# EasyEDA schematic keyless entry car.json
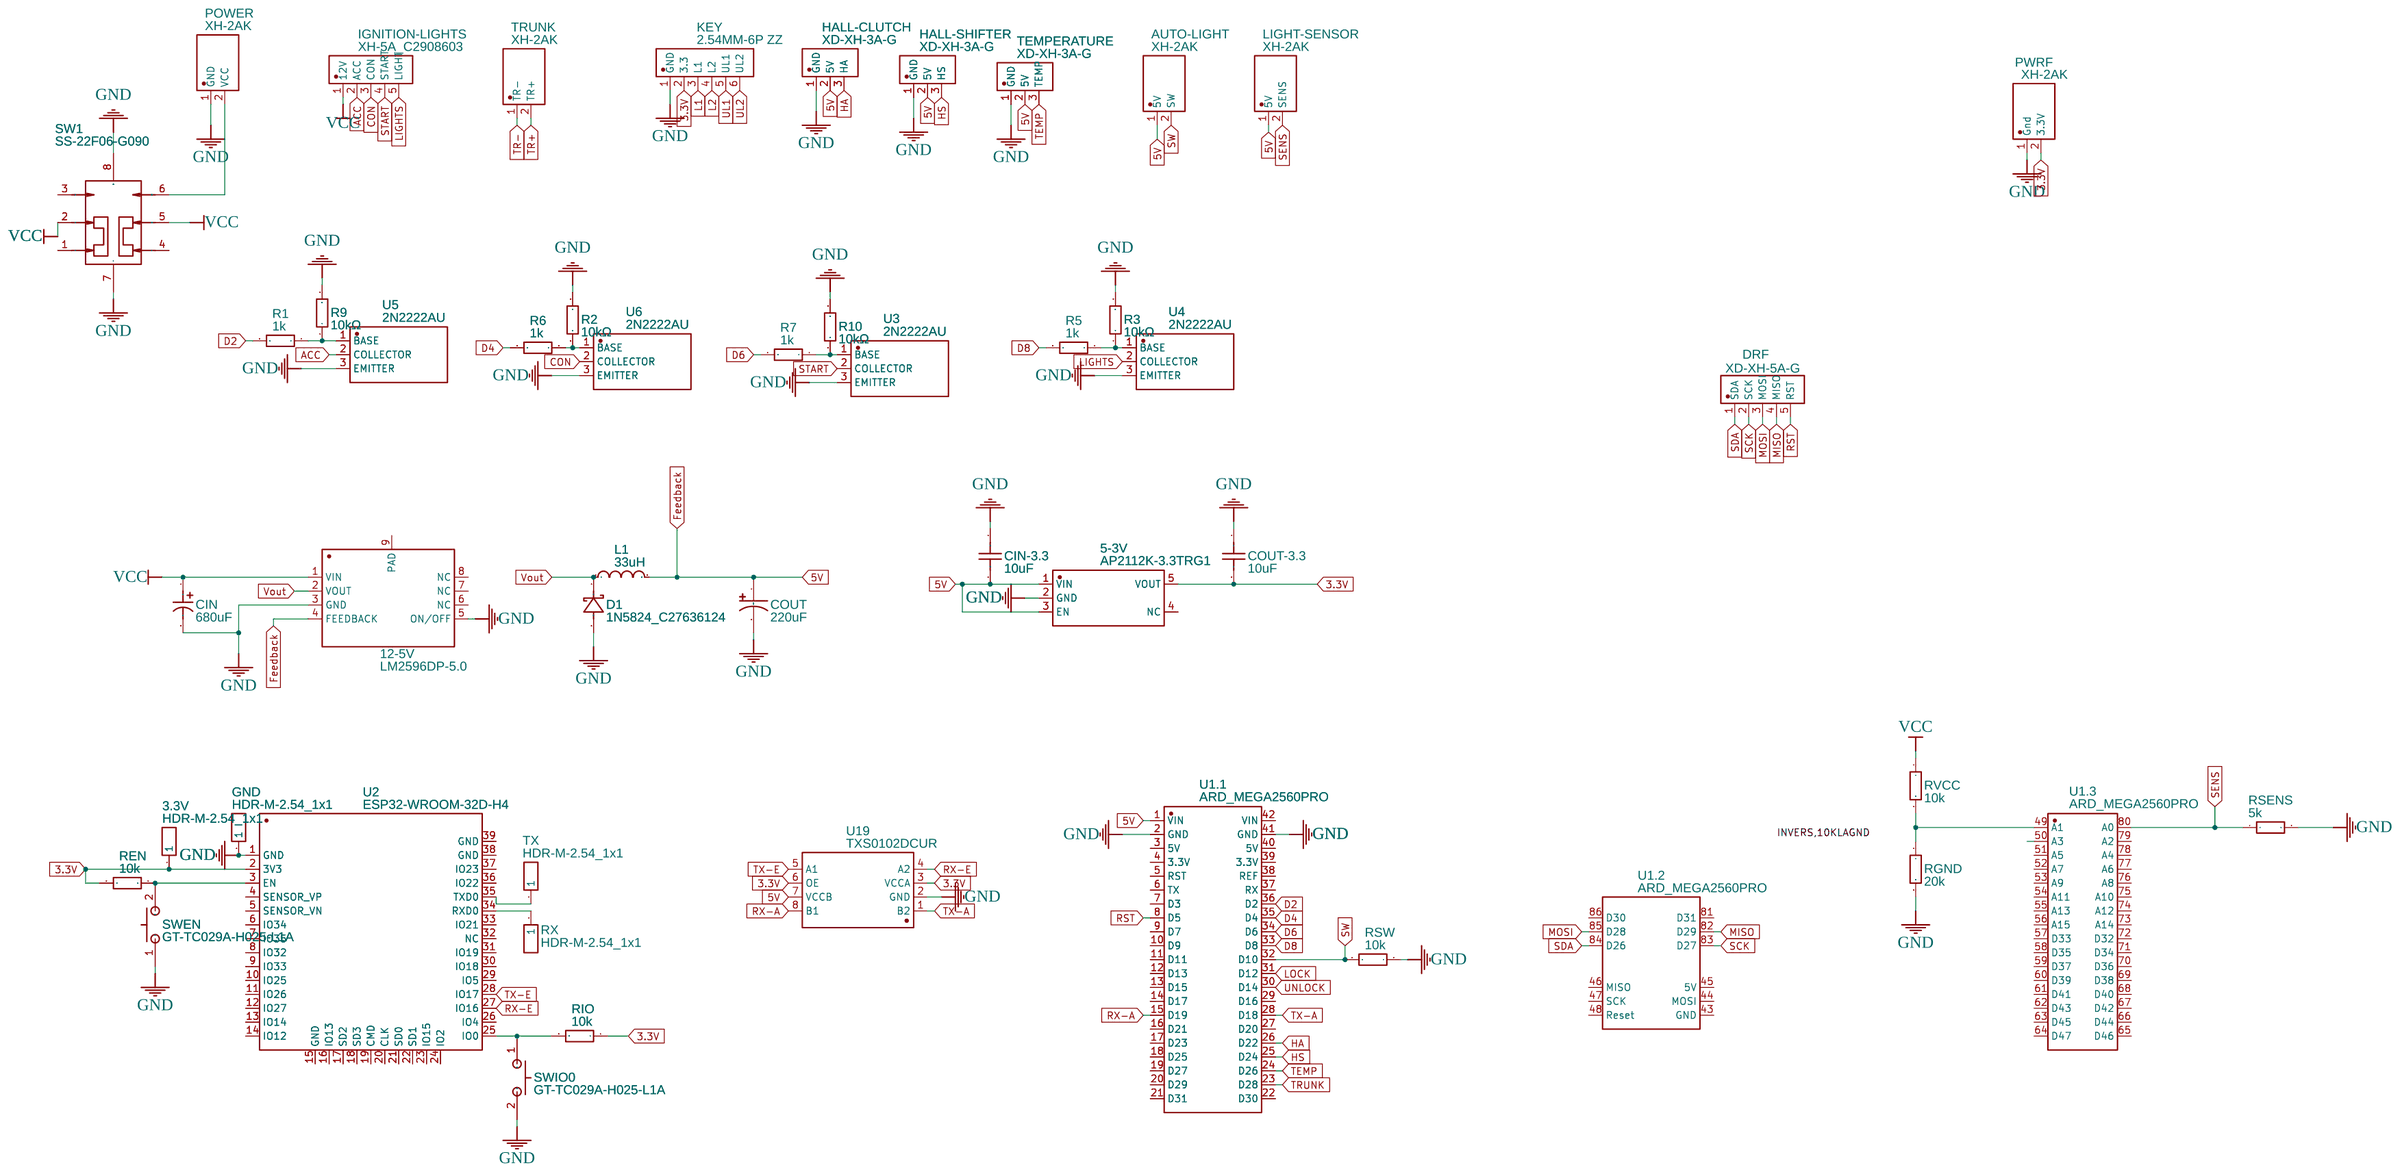
[diagram p0: schematic sheet]

## Parts
3.3V  HDR-M-2.54_1x1  [HDR-M-2.54_1X1]
5-3V  AP2112K-3.3TRG1  [SOT-25-5_L2.9-W1.6-P0.95-LS2.8-BL]
12-5V  LM2596DP-5.0  [SOP-8-PP_L4.9-W3.9-P1.27-LS6.0-BL-EP]
AUTO-LIGHT  XH-2AK  [CONN-TH_XH-2A]
CIN  680uF  [CAP-TH_BD6.3-P2.60-D0.6-FD-1]
CIN-3  10uF  [C0805]  (section 3)
COUT  220uF  [CAP-TH_BD6.3-P2.50-D1.0-FD]
COUT-3  10uF  [C0805]  (section 3)
D1  1N5824_C27636124  [DO-201AD_BD5.3-L9.0-P13.00-D1.3-RD]
DRF  XD-XH-5A-G  [CONN-TH_XH-5A]
GND  HDR-M-2.54_1x1  [HDR-M-2.54_1X1]
HALL-CLUTCH  XD-XH-3A-G  [CONN-TH_3P-P2.50_XH-3A-C9900029692]
HALL-SHIFTER  XD-XH-3A-G  [CONN-TH_3P-P2.50_XH-3A-C9900029692]
IGNITION-LIGHTS  XH-5A_C2908603  [CONN-TH_5P-P2.50_XH-5A]
KEY  2.54MM-6P ZZ  [CONN-TH_6P-P2.50_HCTL_XH-6A_C2908604]
L1  33uH  [IND-SMD_L10.8-W10.0_SLO1040H]
LIGHT-SENSOR  XH-2AK  [CONN-TH_XH-2A]
POWER  XH-2AK  [CONN-TH_XH-2A]
PWRF  XH-2AK  [CONN-TH_XH-2A]
R1  1k  [RES-TH_BD2.3-L6.5-P10.50-D0.5]
R2  10kΩ  [RES-TH_BD2.3-L6.5-P10.50-D0.5]
R3  10kΩ  [RES-TH_BD2.3-L6.5-P10.50-D0.5]
R5  1k  [RES-TH_BD2.3-L6.5-P10.50-D0.5]
R6  1k  [RES-TH_BD2.3-L6.5-P10.50-D0.5]
R7  1k  [RES-TH_BD2.3-L6.5-P10.50-D0.5]
R9  10kΩ  [RES-TH_BD2.3-L6.5-P10.50-D0.5]
R10  10kΩ  [RES-TH_BD2.3-L6.5-P10.50-D0.5]
REN  10k  [RES-TH_BD2.3-L6.5-P10.50-D0.5]
RGND  20k  [RES-TH_BD2.3-L6.5-P10.50-D0.5]
RIO  10k  [RES-TH_BD2.3-L6.5-P10.50-D0.5]
RSENS  5k  [RES-TH_BD2.3-L6.5-P10.50-D0.5]
RSW  10k  [RES-TH_BD2.3-L6.5-P10.50-D0.5]
RVCC  10k  [RES-TH_BD2.3-L6.5-P10.50-D0.5]
RX  HDR-M-2.54_1x1  [HDR-M-2.54_1X1]
SW1  SS-22F06-G090  [SW-TH_6P-L16.5-W7.5-P4.0-LS2.6-TL]
SWEN  GT-TC029A-H025-L1A  [SW-SMD_L3.9-W2.9-P4.40-EH]
SWIO0  GT-TC029A-H025-L1A  [SW-SMD_L3.9-W2.9-P4.40-EH]
TEMPERATURE  XD-XH-3A-G  [CONN-TH_3P-P2.50_XH-3A-C9900029692]
TRUNK  XH-2AK  [CONN-TH_XH-2A]
TX  HDR-M-2.54_1x1  [HDR-M-2.54_1X1]
U1  ARD_MEGA2560PRO  [COMM-SMD_L54.0-W38.0-P2.54_ARD_MEGA2560PRO]  (sections 1,2,3)
U2  ESP32-WROOM-32D-H4  [WIFIM-SMD_ESP32-WROOM-32D]
U3  2N2222AU  [SOT-89-3_L4.5-W2.4-P1.50-LS4.0-BR]
U4  2N2222AU  [SOT-89-3_L4.5-W2.4-P1.50-LS4.0-BR]
U5  2N2222AU  [SOT-89-3_L4.5-W2.4-P1.50-LS4.0-BR]
U6  2N2222AU  [SOT-89-3_L4.5-W2.4-P1.50-LS4.0-BR]
U19  TXS0102DCUR  [VSON8_L2.0-W2.3-P0.50-LS3.1-BL]

## Library data of the parts
3.3V GND RX TX = HDR-M-2.54_1x1: Supplier Part: C81276; Supplier: LCSC; Contributor: LCEDA_Lib
5-3V = AP2112K-3.3TRG1: Contributor: LCSC; Supplier: LCSC; Manufacturer: DIODES(美台); Supplier Part: C51118; JLCPCB Part Class: Extended Part
12-5V = LM2596DP-5.0: Contributor: LCSC; Supplier: LCSC; Supplier Part: C596341; Manufacturer: HTC; JLCPCB Part Class: Extended Part
AUTO-LIGHT LIGHT-SENSOR POWER PWRF TRUNK = XH-2AK: Contributor: LCSC; Supplier: LCSC; Supplier Part: C146104; Manufacturer: BOOMELE(博穆精密); Manufacturer Part: XH-2AK米色; JLCPCB Part Class: Extended Part
CIN = SPT1CM681E12ORVZC: Supplier: LCSC; Supplier Part: C3024241; Manufacturer: Yunxing(云星); JLCPCB Part Class: Extended Part; Contributor: lcsc
CIN-3 COUT-3 = CL21A106KAYNNNE: Supplier: LCSC; Manufacturer: SAMSUNG(三星); Supplier Part: C15850; JLCPCB Part Class: Basic Part
COUT = UPW1A221MED1TD: Contributor: LCSC; Supplier: LCSC; Supplier Part: C225866; Manufacturer: Nichicon(尼吉康); JLCPCB Part Class: Extended Part
D1 = 1N5824_C27636124: Supplier: LCSC; Supplier Part: C27636124; Manufacturer: DOWO(东沃); Manufacturer Part: 1N5824; Contributor: lcsc; JLCPCB Part Class: Extended Part
DRF = XD-XH-5A-G: Supplier: LCSC; Supplier Part: C17700949; Manufacturer: XUNDA(讯答); Contributor: lcsc; JLCPCB Part Class: Extended Part
HALL-CLUTCH HALL-SHIFTER TEMPERATURE = XD-XH-3A-G: Supplier: LCSC; Supplier Part: C17700947; Manufacturer: XUNDA(讯答); Contributor: lcsc; JLCPCB Part Class: Extended Part
IGNITION-LIGHTS = XH-5A_C2908603: Contributor: LCSC; Supplier: LCSC; Supplier Part: C2908603; Manufacturer: HCTL(华灿天禄); Manufacturer Part: XH-5A; JLCPCB Part Class: Extended Part
KEY = 2.54MM-6P ZZ: Supplier: LCSC; Supplier Part: C5368779; Manufacturer: SHOU HAN(首韩); Manufacturer Part: 2.54mm-6P ZZ; Contributor: lcsc; JLCPCB Part Class: Extended Part
L1 = SLO1040H330MTT: Contributor: LCSC; Supplier: LCSC; Supplier Part: C182163; Manufacturer: Sunltech(韩国顺磁); JLCPCB Part Class: Extended Part
R1-R3 R5-R7 R9 R10 REN RGND RIO RSENS RSW RVCC = RI40-1/4W-10KΩ ±5% T: Contributor: LCSC; Supplier: LCSC; Supplier Part: C136549; Manufacturer: CCO(千志电子); JLCPCB Part Class: Extended Part
SW1 = SS-22F06-G090: Contributor: LCSC; Supplier: LCSC; Supplier Part: C2848929; Manufacturer: G-Switch(品赞); JLCPCB Part Class: Extended Part
SWEN SWIO0 = GT-TC029A-H025-L1A: Contributor: LCSC; Supplier: LCSC; Supplier Part: C843666; Manufacturer: G-Switch(品赞); JLCPCB Part Class: Extended Part
U1 = ARD_MEGA2560PRO: Supplier: LCSC; Supplier Part: C9900135944; Manufacturer: null; subpart_no: 1
U2 = ESP32-WROOM-32D-H4: Contributor: lcsc; Supplier: LCSC; Supplier Part: C3013936; Manufacturer: ESPRESSIF(乐鑫); JLCPCB Part Class: Extended Part
U3-U6 = 2N2222AU: Supplier: LCSC; Supplier Part: C21714170; Manufacturer: CBI(创基); Contributor: lcsc; JLCPCB Part Class: Extended Part
U19 = TXS0102DCUR: Supplier: LCSC; Manufacturer: TI(德州仪器); Supplier Part: C53434; JLCPCB Part Class: Extended Part

## Nets
3.3V: 3.3V.1 5-3V.5(VOUT) COUT-3.2 KEY.2(3.3) PWRF.2(3.3V) REN.2 RIO.1 U2.2(3V3) U19.3(VCCA) U19.6(OE)
5V: 5-3V.1(VIN) 5-3V.3(EN) 12-5V.4(FEEDBACK) AUTO-LIGHT.1(5V) CIN-3.2 COUT.1 HALL-CLUTCH.2(5V) HALL-SHIFTER.2(5V) L1.2 LIGHT-SENSOR.1(5V) TEMPERATURE.2(5V) U1.1(VIN) U19.7(VCCB)
GND: 5-3V.2(GND) 12-5V.3(GND) 12-5V.5(ON/OFF) CIN.2 CIN-3.1 COUT.2 COUT-3.1 D1.2(A) GND.1 HALL-CLUTCH.1(GND) HALL-SHIFTER.1(GND) KEY.1(GND) POWER.1(GND) PWRF.1(Gnd) R2.1 R3.2 R9.2 R10.2 RGND.2 RSENS.2 RSW.1 SW1.7 SW1.8 SWEN.1 SWIO0.2 TEMPERATURE.1(GND) U1.2(GND) U1.41(GND) U2.1(GND) U3.3(EMITTER) U4.3(EMITTER) U5.3(EMITTER) U6.3(EMITTER) U19.2(GND)
VCC: 12-5V.1(VIN) CIN.1 IGNITION-LIGHTS.1(12V) RVCC.1 SW1.2 SW1.5
ACC: IGNITION-LIGHTS.2(ACC) U5.2(COLLECTOR)
CON: IGNITION-LIGHTS.3(CON) U6.2(COLLECTOR)
D2: R1.2 U1.36(D2)
D4: R6.2 U1.35(D4)
D6: R7.2 U1.34(D6)
D8: R5.2 U1.33(D8)
HA: HALL-CLUTCH.3(HA) U1.26(D22)
HS: HALL-SHIFTER.3(HS) U1.25(D24)
L1: KEY.3(L1)
L2: KEY.4(L2)
LIGHTS: IGNITION-LIGHTS.5(LIGHT) U4.2(COLLECTOR)
LOCK: U1.31(D12)
MISO: DRF.4(MISO) U1.82(D29)
MOSI: DRF.3(MOSI) U1.85(D28)
RST: DRF.5(RST) U1.8(D5)
RX-A: U1.15(D19) U19.8(B1)
RX-E: U2.27(IO16) U19.4(A2)
SCK: DRF.2(SCK) U1.83(D27)
SDA: DRF.1(SDA) U1.84(D26)
SENS: LIGHT-SENSOR.2(SENS) RSENS.1 U1.80(A0)
START: IGNITION-LIGHTS.4(START) U3.2(COLLECTOR)
SW: AUTO-LIGHT.2(SW) RSW.2 U1.32(D10)
TEMP: TEMPERATURE.3(TEMP) U1.24(D26)
TR+: TRUNK.2(TR+)
TR-: TRUNK.1(TR-)
TRUNK: U1.23(D28)
TX-A: U1.28(D18) U19.1(B2)
TX-E: U2.28(IO17) U19.5(A1)
UL1: KEY.5(UL1)
UL2: KEY.6(UL2)
UNLOCK: U1.30(D14)
Vout: 12-5V.2(VOUT) D1.1(K) L1.1
Net-(POWER-2): POWER.2(VCC) SW1.6
Net-(R1-1): R1.1 R9.1 U5.1(BASE)
Net-(R2-2): R2.2 R6.1 U6.1(BASE)
Net-(R3-1): R3.1 R5.1 U4.1(BASE)
Net-(R7-1): R7.1 R10.1 U3.1(BASE)
Net-(REN-1): REN.1 SWEN.2 U2.3(EN)
Net-(RGND-1): RGND.1 RVCC.2 U1.49(A1)
Net-(RIO-2): RIO.2 SWIO0.1 U2.25(IO0)
Net-(RX-1): RX.1 U2.34(RXD0)
Net-(TX-1): TX.1 U2.35(TXD0)

Not connected (* = marked no-connect by the designer): 5-3V 4(NC); 12-5V 6(NC) 7(NC) 8(NC) 9(PAD); SW1 1 3 4; U1 3(5V) 4(3.3V) 5(RST) 6(TX) 7(D3) 9(D7) 10(D9) 11(D11) 12(D13) 13(D15) 14(D17) 16(D21) 17(D23) 18(D25) 19(D27) 20(D29) 21(D31) 22(D30) 27(D20) 29(D16) 37(RX) 38(REF) 39(3.3V) 40(5V) 42(VIN) 43(GND) 44(MOSI) 45(5V) 46(MISO) 47(SCK) 48(Reset) 50(A3) 51(A5) 52(A7) 53(A9) 54(A11) 55(A13) 56(A15) 57(D33) 58(D35) 59(D37) 60(D39) 61(D41) 62(D43) 63(D45) 64(D47) 65(D46) 66(D44) 67(D42) 68(D40) 69(D38) 70(D36) 71(D34) 72(D32) 73(A14) 74(A12) 75(A10) 76(A8) 77(A6) 78(A4) 79(A2) 81(D31) 86(D30); U2 4(SENSOR_VP) 5(SENSOR_VN) 6(IO34) 7(IO35) 8(IO32) 9(IO33) 10(IO25) 11(IO26) 12(IO27) 13(IO14) 14(IO12) 15(GND) 16(IO13) 17(SD2) 18(SD3) 19(CMD) 20(CLK) 21(SD0) 22(SD1) 23(IO15) 24(IO2) 26(IO4) 29(IO5) 30(IO18) 31(IO19) 32(NC) 33(IO21) 36(IO22) 37(IO23) 38(GND) 39(GND)
